# Altium schematic sheet RP2040.SchDoc
size A4; SheetNumber: 2; SheetTotal: 3
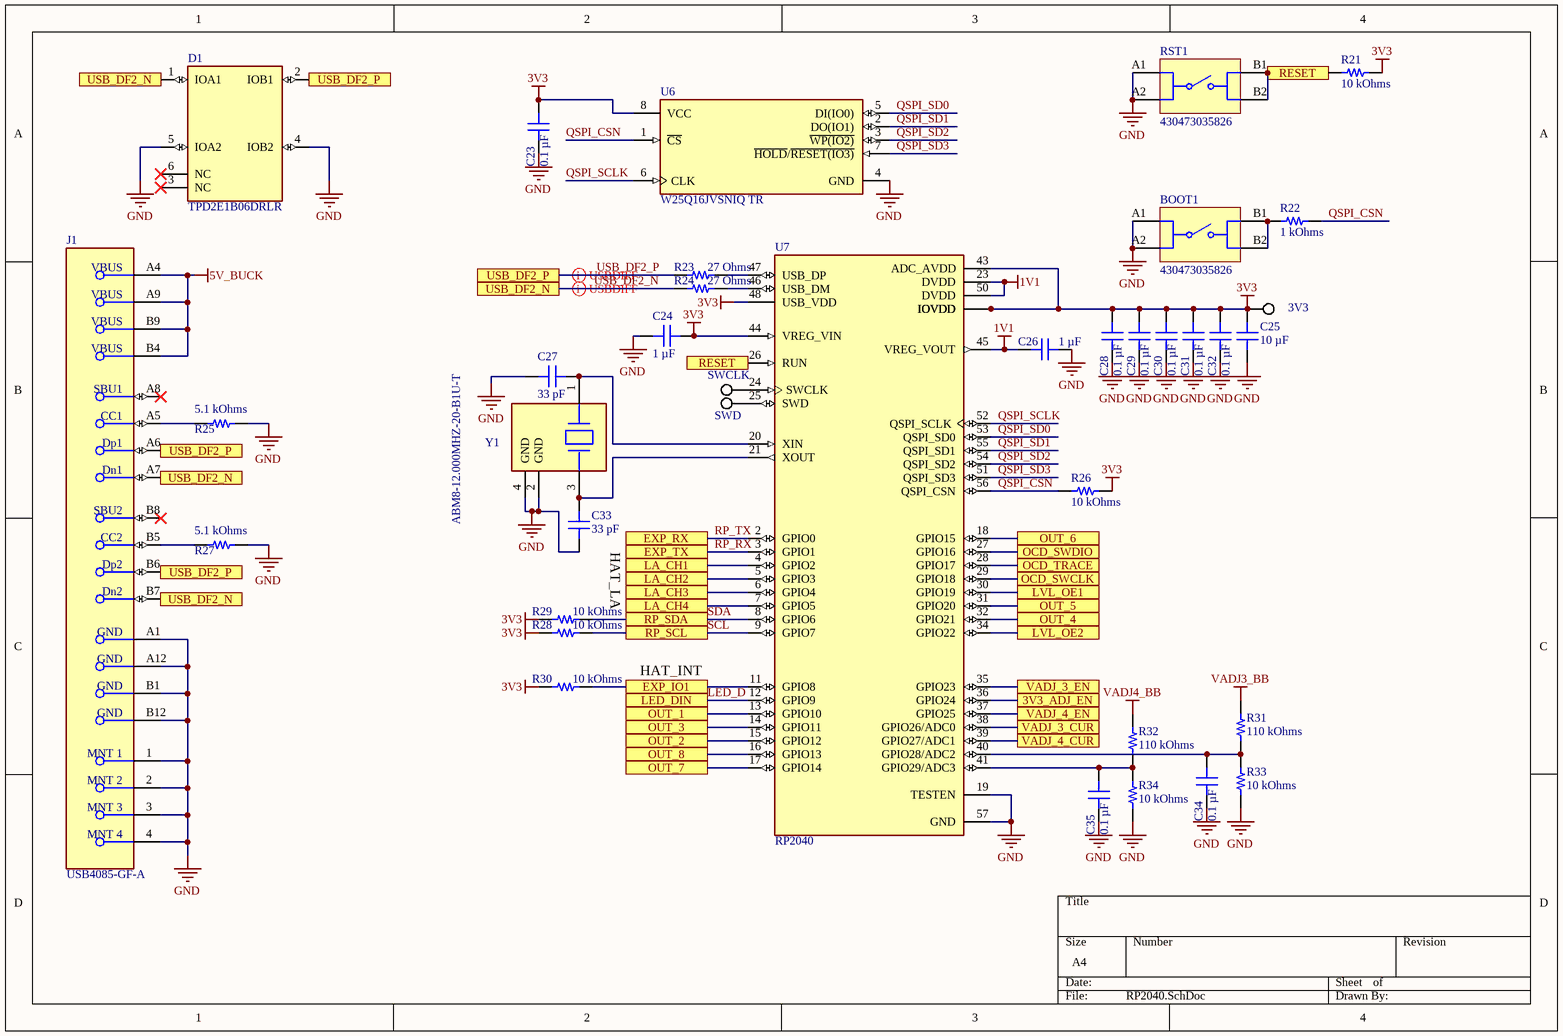
[diagram p0: RP2040.SchDoc]

## Parts
3V3  TP_SMD_1  [TP_1.0mm]  (value not drawn)  (no BOM)
BOOT1  430473035826  [430473035826]
C23  0.1 µF  [CAP 0603_1608]
C24  1 µF  [CAP 0603_1608]
C25  10 µF  [CAP 0603_1608]
C26  1 µF  [CAP 0603_1608]
C27  33 pF  [CAP 0603_1608]
C28  0.1 µF  [CAP 0603_1608]
C29  0.1 µF  [CAP 0603_1608]
C30  0.1 µF  [CAP 0603_1608]
C31  0.1 µF  [CAP 0603_1608]
C32  0.1 µF  [CAP 0603_1608]
C33  33 pF  [CAP 0603_1608]
C34  0.1 µF  [CAP 0603_1608]
C35  0.1 µF  [CAP 0603_1608]
D1  TPD2E1B06DRLR  [FP-DRL0006A-MFG]
J1  USB4085-GF-A  [FP-USB4085-GF-A-MFG]
R21  10 kOhms  [RES 0603_1608]
R22  1 kOhms  [RES 0603_1608]
R23  27 Ohms  [RES 0603_1608]
R24  27 Ohms  [RES 0603_1608]
R25  5.1 kOhms  [RES 0603_1608]
R26  10 kOhms  [RES 0603_1608]
R27  5.1 kOhms  [RES 0603_1608]
R28  10 kOhms  [RES 0603_1608]
R29  10 kOhms  [RES 0603_1608]
R30  10 kOhms  [RES 0603_1608]
R31  110 kOhms  [RES 0603_1608]
R32  110 kOhms  [RES 0603_1608]
R33  10 kOhms  [RES 0603_1608]
R34  10 kOhms  [RES 0603_1608]
RST1  430473035826  [430473035826]
SWCLK  TP_SMD_1  [TP_1.0mm]  (value not drawn)  (no BOM)
SWD  TP_SMD_1  [TP_1.0mm]  (value not drawn)  (no BOM)
U6  W25Q16JVSNIQ TR  [FP-W25Q16JVSNIQ_TR-IPC_A]
U7  RP2040  [QFN40P700X700X90-57N]
Y1  ABM8-12.000MHZ-20-B1U-T  [FP-ABM8-MFG]

## Ports
3V3_ADJ_EN, EXP_IO1, EXP_RX, EXP_TX, LA_CH1, LA_CH2, LA_CH3, LA_CH4, LED_DIN, LVL_OE1, LVL_OE2, OCD_SWCLK, OCD_SWDIO, OCD_TRACE, OUT_1, OUT_2, OUT_3, OUT_4, OUT_5, OUT_6, OUT_7, OUT_8, RESET, RP_SCL, RP_SDA, USB_DF2_N, USB_DF2_P, VADJ_3_CUR, VADJ_3_EN, VADJ_4_CUR, VADJ_4_EN

## Nets
1V1: C26.2 U7.23(DVDD) U7.45(VREG_VOUT) U7.50(DVDD)
3V3: 3V3.1 C23.2 C24.2 C25.2 C28.2 C29.2 C30.2 C31.2 C32.2 R21.1 R26.1 R28.1 R29.1 R30.1 U6.8(VCC) U7.1(IOVDD) U7.10(IOVDD) U7.22(IOVDD) U7.33(IOVDD) U7.42(IOVDD) U7.43(ADC_AVDD) U7.44(VREG_VIN) U7.48(USB_VDD) U7.49(IOVDD)
5V_BUCK: J1.A4(VBUS) J1.A9(VBUS) J1.B4(VBUS) J1.B9(VBUS)
GND: BOOT1.A1 BOOT1.A2 C23.1 C24.1 C25.1 C26.1 C27.1 C28.1 C29.1 C30.1 C31.1 C32.1 C33.1 C34.1 C35.1 D1.4(IOB2) D1.5(IOA2) J1.1(MNT_1) J1.2(MNT_2) J1.3(MNT_3) J1.4(MNT_4) J1.A1(GND) J1.A12(GND) J1.B1(GND) J1.B12(GND) R25.2 R27.2 R33.1 R34.1 RST1.A1 RST1.A2 U6.4(GND) U7.19(TESTEN) U7.57(GND) Y1.2(GND) Y1.4(GND)
VADJ3_BB: R31.2
VADJ4_BB: R32.2
3V3_ADJ_EN: U7.36(GPIO24) ; port 3V3_ADJ_EN
EXP_IO1: R30.2 U7.11(GPIO8) ; port EXP_IO1
LA_CH1: U7.4(GPIO2) ; port LA_CH1
LA_CH2: U7.5(GPIO3) ; port LA_CH2
LA_CH3: U7.6(GPIO4) ; port LA_CH3
LA_CH4: U7.7(GPIO5) ; port LA_CH4
LED_D: U7.12(GPIO9) ; port LED_DIN
LVL_OE1: U7.30(GPIO19) ; port LVL_OE1
LVL_OE2: U7.34(GPIO22) ; port LVL_OE2
OCD_SWCLK: U7.29(GPIO18) ; port OCD_SWCLK
OCD_SWDIO: U7.27(GPIO16) ; port OCD_SWDIO
OCD_TRACE: U7.28(GPIO17) ; port OCD_TRACE
OUT_1: U7.13(GPIO10) ; port OUT_1
OUT_2: U7.15(GPIO12) ; port OUT_2
OUT_3: U7.14(GPIO11) ; port OUT_3
OUT_4: U7.32(GPIO21) ; port OUT_4
OUT_5: U7.31(GPIO20) ; port OUT_5
OUT_6: U7.18(GPIO15) ; port OUT_6
OUT_7: U7.17(GPIO14) ; port OUT_7
OUT_8: U7.16(GPIO13) ; port OUT_8
QSPI_CSN: R22.2 R26.2 U6.1(~{CS}) U7.56(QSPI_CSN)
QSPI_SCLK: U6.6(CLK) U7.52(QSPI_SCLK)
QSPI_SD0: U6.5(DI(IO0)) U7.53(QSPI_SD0)
QSPI_SD1: U6.2(DO(IO1)) U7.55(QSPI_SD1)
QSPI_SD2: U6.3(~{WP(IO2)}) U7.54(QSPI_SD2)
QSPI_SD3: U6.7(~{HOLD}/~{RESET(IO3)}) U7.51(QSPI_SD3)
RESET: R21.2 RST1.B1 RST1.B2 U7.26(RUN) ; port RESET
RP_RX: U7.3(GPIO1) ; port EXP_TX
RP_TX: U7.2(GPIO0) ; port EXP_RX
SCL: R28.2 U7.9(GPIO7) ; port RP_SCL
SDA: R29.2 U7.8(GPIO6) ; port RP_SDA
USB_DF2_N: D1.1(IOA1) J1.A7(Dn1) J1.B7(Dn2) R24.1 ; port USB_DF2_N
USB_DF2_P: D1.2(IOB1) J1.A6(Dp1) J1.B6(Dp2) R23.1 ; port USB_DF2_P
VADJ_3_CUR: U7.38(GPIO26/ADC0) ; port VADJ_3_CUR
VADJ_3_EN: U7.35(GPIO23) ; port VADJ_3_EN
VADJ_4_CUR: U7.39(GPIO27/ADC1) ; port VADJ_4_CUR
VADJ_4_EN: U7.37(GPIO25) ; port VADJ_4_EN
NetBOOT1_B1: BOOT1.B1 BOOT1.B2 R22.1
NetC27_2: C27.2 U7.20(XIN) Y1.1
NetC33_2: C33.2 U7.21(XOUT) Y1.3
NetC34_2: C34.2 R31.1 R33.2 U7.40(GPIO28/ADC2)
NetC35_2: C35.2 R32.1 R34.2 U7.41(GPIO29/ADC3)
NetJ1_A5: J1.A5(CC1) R25.1
NetJ1_B5: J1.B5(CC2) R27.1
NetR23_2: R23.2 U7.47(USB_DP)
NetR24_2: R24.2 U7.46(USB_DM)
NetSWCLK_1: SWCLK.1 U7.24(SWCLK)
NetSWD_1: SWD.1 U7.25(SWD)

Not connected (* = marked no-connect by the designer): D1 3(NC)* 6(NC)*; J1 A8(SBU1)* B8(SBU2)*

## Layout directives
differential pair; differential pair class USBDIFF: USB_DF2_N, USB_DF2_P

## Notes on the sheet
- HAT_LA
- HAT_INT

## Library data of the parts
BOOT1 RST1 = CMP-1455-00006-5: Switch Tactile Spst-no 0.05A 12V; Actuator Material: Liquid Crystal Polymer, Polymer; Switch Travel: 250µm; Throw Configuration: SPST; Illumination Type: Non-Illuminated; Insulation Resistance: 100MΩ; Current Rating: 50mA; Switch Function: Off-Mom; Mechanical Life: 500kcycles; Min Operating Temperature: -40°C; Packaging: Tape and Reel; Max Operating Temperature: 85°C; Mount: Surface Mount; Contact Plating: Silver; RoHS: Compliant; Voltage Rating: 12V; Height: 3.5mm
C23 C28-C32 C34 C35 = CGA3E2X7R1H104M080AE: CAP CER 0.1UF 50V X7R 0603; manufacturer: TDK Corporation; Tolerance: ±20%; Part Number: CGA3E2X7R1H104M080AE; Value: 0.1 µF; Applications: Automotive, Boardflex Sensitive; Capacitance: 0.1 µF; componentlink1description: Datasheet; componentlink1url: https://product.tdk.com/info/en/catalog/datasheets/mlcc_automotive_soft_en.pdf?ref_disty=digikey; componentlink2description: DigiKey Link; componentlink2url: https://www.digikey.com/en/products/detail/tdk-corporation/CGA3E2X7R1H104M080AE/4490595; Device Package: 0603 (1608 Metric); Features: Soft Termination; lastupdated: 09/02/2024 20:10:15; Lifecycle Status: Active; Minimum Order: 1; Mounting Type: Surface Mount, MLCC; Operating Temperature: -55°C ~ 125°C; Package / Case: 0603 (1608 Metric); packaging: TapeAndReel; partid: 13634; Part Status: Active; price: 0.03; Ratings: AEC-Q200; series: CGA; Size / Dimension: 0.063" L x 0.031" W (1.60mm x 0.80mm); Supplier 1: DigiKey; Supplier Part Number 1: 445-15958-1-ND; Temperature Coefficient: X7R; Thickness (Max): 0.037" (0.95mm); Voltage - Rated: 50V
C24 C26 = C1608X5R1H105K080AB: CAP CER 1UF 50V X5R 0603; manufacturer: TDK Corporation; Tolerance: ±10%; Part Number: C1608X5R1H105K080AB; Value: 1 µF; Applications: General Purpose; Capacitance: 1 µF; componentlink1description: Datasheet; componentlink1url: https://product.tdk.com/info/en/catalog/datasheets/mlcc_commercial_general_en.pdf?ref_disty=digikey; componentlink2description: DigiKey Link; componentlink2url: https://www.digikey.com/en/products/detail/tdk-corporation/C1608X5R1H105K080AB/2732903; Device Package: 0603 (1608 Metric); Features: Low ESL; lastupdated: 09/02/2024 20:10:02; Lifecycle Status: Active; Minimum Order: 1; Mounting Type: Surface Mount, MLCC; Operating Temperature: -55°C ~ 85°C; Package / Case: 0603 (1608 Metric); packaging: TapeAndReel; partid: 36337; Part Status: Active; price: 0.02; series: C; Size / Dimension: 0.063" L x 0.031" W (1.60mm x 0.80mm); Supplier 1: DigiKey; Supplier Part Number 1: 445-7468-1-ND; Temperature Coefficient: X5R; Thickness (Max): 0.035" (0.90mm); Voltage - Rated: 50V
C25 = KGM15CS61E106MT: CAP CER 10UF 25V X6S 0603; manufacturer: KYOCERA AVX; Tolerance: ±20%; Part Number: KGM15CS61E106MT; Value: 10 µF; Applications: General Purpose; Capacitance: 10 µF; componentlink1description: Datasheet; componentlink1url: https://datasheets.kyocera-avx.com/x6s-dielectric.pdf; componentlink2description: DigiKey Link; componentlink2url: https://www.digikey.com/en/products/detail/kyocera-avx/KGM15CS61E106MT/16602925; Device Package: 0603 (1608 Metric); lastupdated: 09/02/2024 20:09:18; Lifecycle Status: Active; Minimum Order: 1; Mounting Type: Surface Mount, MLCC; Operating Temperature: -55°C ~ 105°C; Package / Case: 0603 (1608 Metric); packaging: TapeAndReel; partid: 52144; Part Status: Active; price: 0.06; series: KGM - X6S; Size / Dimension: 0.063" L x 0.031" W (1.60mm x 0.80mm); Supplier 1: DigiKey; Supplier Part Number 1: 478-KGM15CS61E106MTCT-ND; Temperature Coefficient: X6S; Thickness (Max): 0.039" (1.00mm); Voltage - Rated: 25V
C27 C33 = CC0603GRNPO9BN330: CAP CER 33PF 50V C0G/NPO 0603; manufacturer: Yageo; Temperature Coefficient: C0G, NP0; Tolerance: ±2%; Part Number: CC0603GRNPO9BN330; Value: 33 pF; Applications: General Purpose; Capacitance: 33 pF; componentlink1description: Datasheet; componentlink1url: https://www.yageo.com/upload/media/product/productsearch/datasheet/mlcc/UPY-GP_NP0_16V-to-50V_17.pdf; componentlink2description: DigiKey Link; componentlink2url: https://www.digikey.com/en/products/detail/yageo/CC0603GRNPO9BN330/5883557; Device Package: 0603 (1608 Metric); lastupdated: 09/02/2024 20:10:23; Lifecycle Status: Active; Minimum Order: 1; Mounting Type: Surface Mount, MLCC; Operating Temperature: -55°C ~ 125°C; Package / Case: 0603 (1608 Metric); packaging: TapeAndReel; partid: 8045; Part Status: Active; price: 0.01; series: CC; Size / Dimension: 0.063" L x 0.031" W (1.60mm x 0.80mm); Supplier 1: DigiKey; Supplier Part Number 1: 311-3931-1-ND; Thickness (Max): 0.035" (0.90mm); Voltage - Rated: 50V
D1 = CMP-04985-000003-1: TVS DIODE 5.5V 15V 6SOT; Manufacturer: Texas Instruments; Peak Pulse Power: 35W; Peak Pulse Current: 2.5A; Direction: Bidirectional; Standoff Height: 0mm; Interface: I2C,USB,LVDS,Other; Number Of Channels: 2; Breakdown Voltage: 7V; Ambient Temperature Range High: +125°C; Package: DRL0006A; Automotive: No; Lead Free: Yes; Temperature Range Low: -40°C; Reverse Standoff Voltage: 5.5V; Clamping Voltage: 15V; Mouser Description: ESD Suppressors / TVS Diodes 2-CH system level ESD protect device; Temperature Range High: +125°C; Device Class L1: Circuit Protection; ComponentLink2Description: Datasheet; RoHS: TRUE; Ambient Temperature Range Low: -40°C; Height: 0.6mm; Device Class L3: unset; Device Class L2: ESD and Circuit Protection ICs; Temperature: -40°C to +125°C; Octopart: https://octopart.com/tpd2e1b06drlr-texas+instruments-30488860; ComponentLink2URL: http://www.ti.com/lit/ds/symlink/tpd2e1b06.pdf; Category: Diode; Manufacturer Part Number: TPD2E1B06DRLR; Digikey Description: TVS DIODE 5.5V 15V 6SOT
J1 = CMP-196119-000001-2: CONN RCPT USB2.0 TYPE C 24POS RA; Gender: Receptacle; Number of Positions: 16; USB Standard: USB 2.0; Orientation: Right Angle; Contact Plating: Gold; Contact Material: Copper Alloy
R21 R26 R28-R30 R33 R34 = SG73S1JTTD1002F: RES 10K OHM 1% 1/5W 0603; Manufacturer: KOA Speer Electronics, Inc.; Power (Watts): 0.2W, 1/5W; Temperature Coefficient: ±100ppm/°C; Part Number: SG73S1JTTD1002F; Value: 10 kOhms; ComponentLink1Description: Datasheet; ComponentLink1URL: http://www.koaspeer.com/catimages/Products/SG73S/SG73S.pdf; ComponentLink2Description: DigiKey Link; ComponentLink2URL: https://www.digikey.com/en/products/detail/koa-speer-electronics-inc/SG73S1JTTD1002F/10279969; Composition: Thick Film; Device Package: 0603 (1608 Metric); Features: Automotive AEC-Q200, Moisture Resistant, Pulse Withstanding; Height - Seated (Max): 0.022" (0.55mm); LastUpdated: 09/02/2024 20:43:35; Lifecycle Status: Active; Minimum Order: 1; Number of Terminations: 2; Operating Temperature: -55°C ~ 155°C; Package / Case: 0603 (1608 Metric); Packaging: TapeAndReel; PartId: 5386; Part Status: Active; Price: 0.01; Ratings: AEC-Q200; Resistance: 10 kOhms; Series: SG73S; Size / Dimension: 0.063" L x 0.031" W (1.60mm x 0.80mm); Supplier 1: DigiKey; Supplier Part Number 1: 2019-SG73S1JTTD1002FCT-ND; Supplier Device Package: 0603; Tolerance: ±1%
R22 = ERJ-PA3J102V: RES SMD 1K OHM 5% 1/3W 0603; Manufacturer: Panasonic Electronic Components; Power (Watts): 0.333W, 1/3W; Temperature Coefficient: ±200ppm/°C; Part Number: ERJ-PA3J102V; Value: 1 kOhms; ComponentLink1Description: Datasheet; ComponentLink1URL: https://industrial.panasonic.com/cdbs/www-data/pdf/RDO0000/AOA0000C331.pdf; ComponentLink2Description: DigiKey Link; ComponentLink2URL: https://www.digikey.com/en/products/detail/panasonic-electronic-components/ERJ-PA3J102V/5035970; Composition: Thick Film; Device Package: 0603 (1608 Metric); Features: Automotive AEC-Q200, Pulse Withstanding; Height - Seated (Max): 0.022" (0.55mm); LastUpdated: 09/02/2024 20:42:47; Lifecycle Status: Active; Minimum Order: 1; Number of Terminations: 2; Operating Temperature: -55°C ~ 155°C; Package / Case: 0603 (1608 Metric); Packaging: TapeAndReel; PartId: 17507; Part Status: Active; Price: 0.01; Ratings: AEC-Q200; Resistance: 1 kOhms; Series: ERJ-PA3; Size / Dimension: 0.063" L x 0.031" W (1.60mm x 0.80mm); Supplier 1: DigiKey; Supplier Part Number 1: P1KBZCT-ND; Supplier Device Package: 0603; Tolerance: ±5%
R23 R24 = CRCW060327R0FKEA: RES SMD 27 OHM 1% 1/10W 0603; Manufacturer: Vishay Dale; Power (Watts): 0.1W, 1/10W; Temperature Coefficient: ±100ppm/°C; Part Number: CRCW060327R0FKEA; Value: 27 Ohms; ComponentLink1Description: Datasheet; ComponentLink1URL: http://www.vishay.com/docs/20035/dcrcwe3.pdf; ComponentLink2Description: DigiKey Link; ComponentLink2URL: https://www.digikey.com/en/products/detail/vishay-dale/CRCW060327R0FKEA/1174487; Composition: Thick Film; Device Package: 0603 (1608 Metric); Features: Automotive AEC-Q200; Height - Seated (Max): 0.020" (0.50mm); LastUpdated: 09/02/2024 20:43:24; Lifecycle Status: Active; Minimum Order: 1; Number of Terminations: 2; Operating Temperature: -55°C ~ 155°C; Package / Case: 0603 (1608 Metric); Packaging: TapeAndReel; PartId: 8035; Part Status: Active; Price: 0.01; Ratings: AEC-Q200; Resistance: 27 Ohms; Series: CRCW; Size / Dimension: 0.061" L x 0.033" W (1.55mm x 0.85mm); Supplier 1: DigiKey; Supplier Part Number 1: 541-27.0HCT-ND; Supplier Device Package: 0603; Tolerance: ±1%
R25 R27 = RMCF0603FT5K10: RES 5.1K OHM 1% 1/10W 0603; Manufacturer: Stackpole Electronics Inc; Power (Watts): 0.1W, 1/10W; Temperature Coefficient: ±100ppm/°C; Part Number: RMCF0603FT5K10; Value: 5.1 kOhms; ComponentLink1Description: Datasheet; ComponentLink1URL: https://www.seielect.com/catalog/sei-rmcf_rmcp.pdf; ComponentLink2Description: DigiKey Link; ComponentLink2URL: https://www.digikey.com/en/products/detail/stackpole-electronics-inc/RMCF0603FT5K10/1760908; Composition: Thick Film; Device Package: 0603 (1608 Metric); Features: Automotive AEC-Q200; Height - Seated (Max): 0.022" (0.55mm); LastUpdated: 09/02/2024 20:43:14; Lifecycle Status: Active; Minimum Order: 1; Number of Terminations: 2; Operating Temperature: -55°C ~ 155°C; Package / Case: 0603 (1608 Metric); Packaging: CutTape; PartId: 10617; Part Status: Active; Price: 0.01; Ratings: AEC-Q200; Resistance: 5.1 kOhms; Series: RMCF; Size / Dimension: 0.061" L x 0.031" W (1.55mm x 0.80mm); Supplier 1: DigiKey; Supplier Part Number 1: RMCF0603FT5K10CT-ND; Supplier Device Package: 0603; Tolerance: ±1%
R31 R32 = CRCW0603110KFKEA: RES SMD 110K OHM 1% 1/10W 0603; Manufacturer: Vishay Dale; Power (Watts): 0.1W, 1/10W; Temperature Coefficient: ±100ppm/°C; Part Number: CRCW0603110KFKEA; Value: 110 kOhms; ComponentLink1Description: Datasheet; ComponentLink1URL: http://www.vishay.com/docs/20035/dcrcwe3.pdf; ComponentLink2Description: DigiKey Link; ComponentLink2URL: https://www.digikey.com/en/products/detail/vishay-dale/CRCW0603110KFKEA/1174900; Composition: Thick Film; Device Package: 0603 (1608 Metric); Features: Automotive AEC-Q200; Height - Seated (Max): 0.020" (0.50mm); LastUpdated: 09/02/2024 20:43:25; Lifecycle Status: Active; Minimum Order: 1; Number of Terminations: 2; Operating Temperature: -55°C ~ 155°C; Package / Case: 0603 (1608 Metric); Packaging: TapeAndReel; PartId: 7799; Part Status: Active; Price: 0.01; Ratings: AEC-Q200; Resistance: 110 kOhms; Series: CRCW; Size / Dimension: 0.061" L x 0.033" W (1.55mm x 0.85mm); Supplier 1: DigiKey; Supplier Part Number 1: 541-110KHCT-ND; Supplier Device Package: 0603; Tolerance: ±1%
U6 = CMP-78876-000009-2: IC FLASH 16MBIT SPI/QUAD 8SOIC; NexarPartId: 75645707; Max Supply Voltage: 3.6V; Memory Size: 2MB; Interface: SPI; Access Time: 5ms; Min Supply Voltage: 2.7V; RoHS: Non-Compliant; Min Operating Temperature: -40°C; Memory Type: FLASH; Height: 1.75mm; Schedule B: 8542320070, 8542320070; Ambient Temperature Range High: 85°C; Max Operating Temperature: 85°C
U7 = RP2040: RP2040 chip for Raspberry Pi Pico - ARM® Cortex®-M0+ MCU 32-Bit; SnapEDA_Link: https://www.snapeda.com/parts/RP2040/Raspberry+Pi/view-part/?ref=snap; Package: None; Value: *; MF: Raspberry Pi; MP: RP2040; Check_prices: https://www.snapeda.com/parts/RP2040/Raspberry+Pi/view-part/?ref=eda
Y1 = CMP-27762-006596-1: Crystal 12MHz ±10ppm 20pF SMD-4 3.2mm x 2.5mm